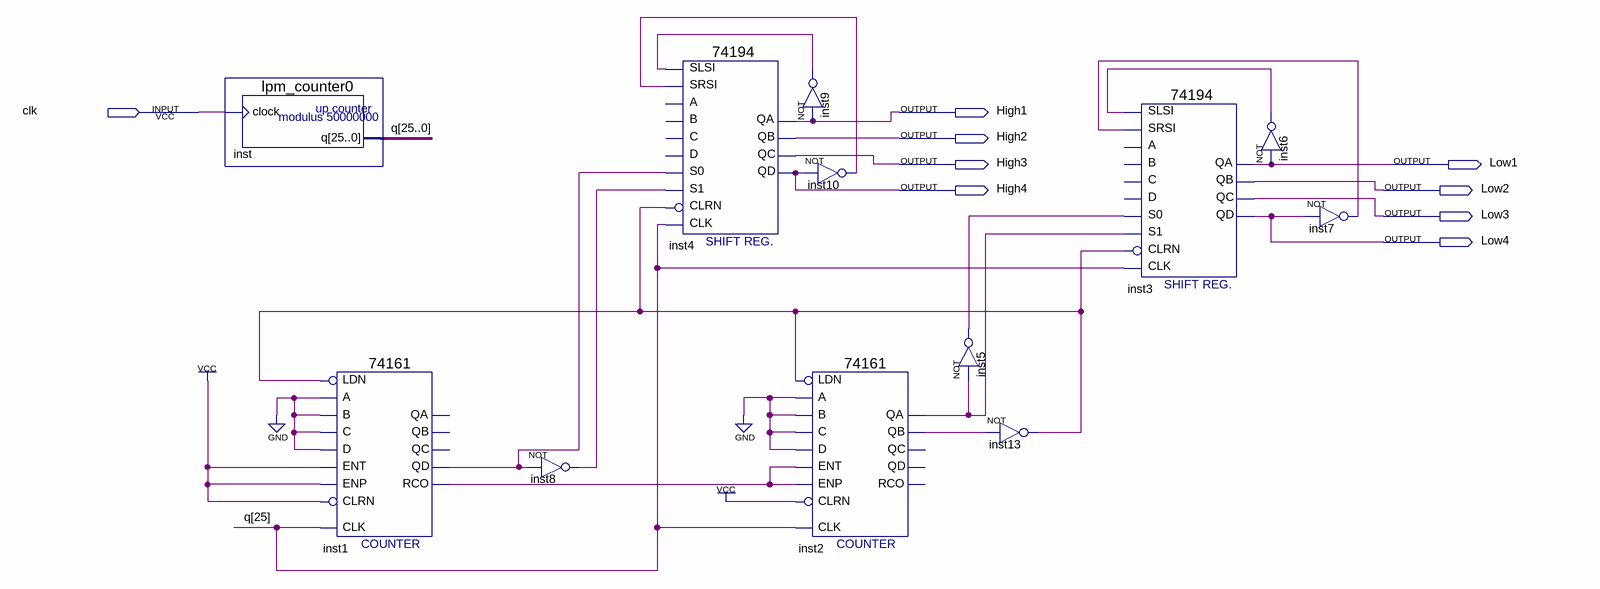
[diagram p0: schematic sheet]
// Quartus schematic 3-3.bdf as structural Verilog: 12 symbols, 9 pins
module \3-3  (
  input  clk,
  output High1,
  output High2,
  output High3,
  output Low1,
  output High4,
  output Low2,
  output Low3,
  output Low4
);

  wire inst1_qd, inst1_rco, inst2_qa, inst2_qb, inst5_out, inst6_out, inst7_out, inst8_out, inst9_out,
       inst10_out, inst13_out;
  wire [25:0] q;

  lpm_counter0 inst (.clock(clk), .q(q));
  \74161  inst1 (
    .CLRN(1'b1), .CLK(q[25]), .ENP(1'b1), .LDN(inst13_out), .A(1'b0), .D(1'b0), .ENT(1'b1), .B(1'b0),
    .C(1'b0), .QD(inst1_qd), .RCO(inst1_rco));  // open: QC, QB, QA
  not inst8 (inst8_out, inst1_qd);
  \74194  inst4 (
    .SLSI(inst9_out), .SRSI(inst10_out), .CLK(q[25]), .CLRN(inst13_out), .S1(inst8_out), .S0(inst1_qd),
    .QA(High1), .QB(High2), .QC(High3), .QD(High4));  // open: B, C, D, A
  not inst9 (inst9_out, High1);
  not inst10 (inst10_out, High4);
  \74161  inst2 (
    .CLRN(1'b1), .CLK(q[25]), .ENP(inst1_rco), .LDN(inst13_out), .A(1'b0), .D(1'b0), .ENT(inst1_rco),
    .B(1'b0), .C(1'b0), .QB(inst2_qb), .QA(inst2_qa));  // open: QD, QC, RCO
  not inst5 (inst5_out, inst2_qa);
  not inst13 (inst13_out, inst2_qb);
  \74194  inst3 (
    .SLSI(inst6_out), .SRSI(inst7_out), .CLK(q[25]), .CLRN(inst13_out), .S1(inst2_qa), .S0(inst5_out),
    .QA(Low1), .QB(Low2), .QC(Low3), .QD(Low4));  // open: B, C, D, A
  not inst6 (inst6_out, Low1);
  not inst7 (inst7_out, Low4);
endmodule
